# EAGLE design untitled (EAGLE 4.16)
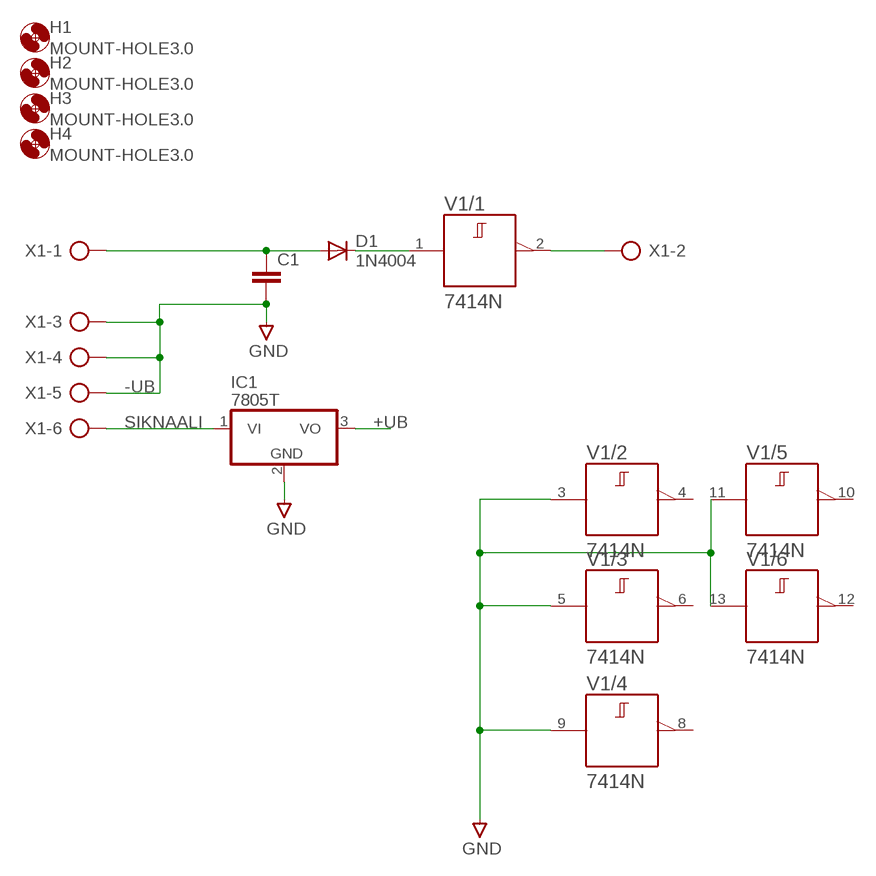
[diagram p0: schematic, sheet 1]

## Parts
C1  C-EU050-035X075  [C050-035X075]
D1  1N4004  [DO41-10]
H1  MOUNT-HOLE3.0  [3,0]
H2  MOUNT-HOLE3.0  [3,0]
H3  MOUNT-HOLE3.0  [3,0]
H4  MOUNT-HOLE3.0  [3,0]
IC1  7805T  [TO220H]
V1  7414N  [DIL14]
X1  AK300/6  [AK300/6]

## Nets
+UB: IC1.3(VO)
-UB: C1.2 IC1.2(GND) V1.3(/2:A) V1.5(/3:A) V1.9(/4:A) V1.11(/5:A) V1.13(/6:A) X1.3 X1.4 X1.5 ; supply symbol labelled GND
N$1: C1.1 D1.A X1.1
N$2: D1.C V1.1(/1:A)
N$3: V1.2(/1:Y) X1.2
SIKNAALI: IC1.1(VI) X1.6
Unconnected: V1.4(/2:Y) V1.6(/3:Y) V1.8(/4:Y) V1.10(/5:Y) V1.12(/6:Y)

## Power pins joined to a net without a drawn wire
+UB: V1.14(/+UB:+UB)
-UB: V1.7(/-UB:-UB)

## Library data of the parts
C1 = rcl:C-EU: CAPACITOR, European symbol
D1 = diode:1N4004: DIODE general purpose rectifier, 1 A
H1-H4 = holes:MOUNT-HOLE: MOUNTING HOLE with drill center marker
IC1 = linear2:78*: Positive VOLTAGE REGULATOR
V1 = 74ttl-din:74*14: Hex schmitt trigger INVERTER
X1 = con-ptr500:AK300/6: CONNECTOR

## Board
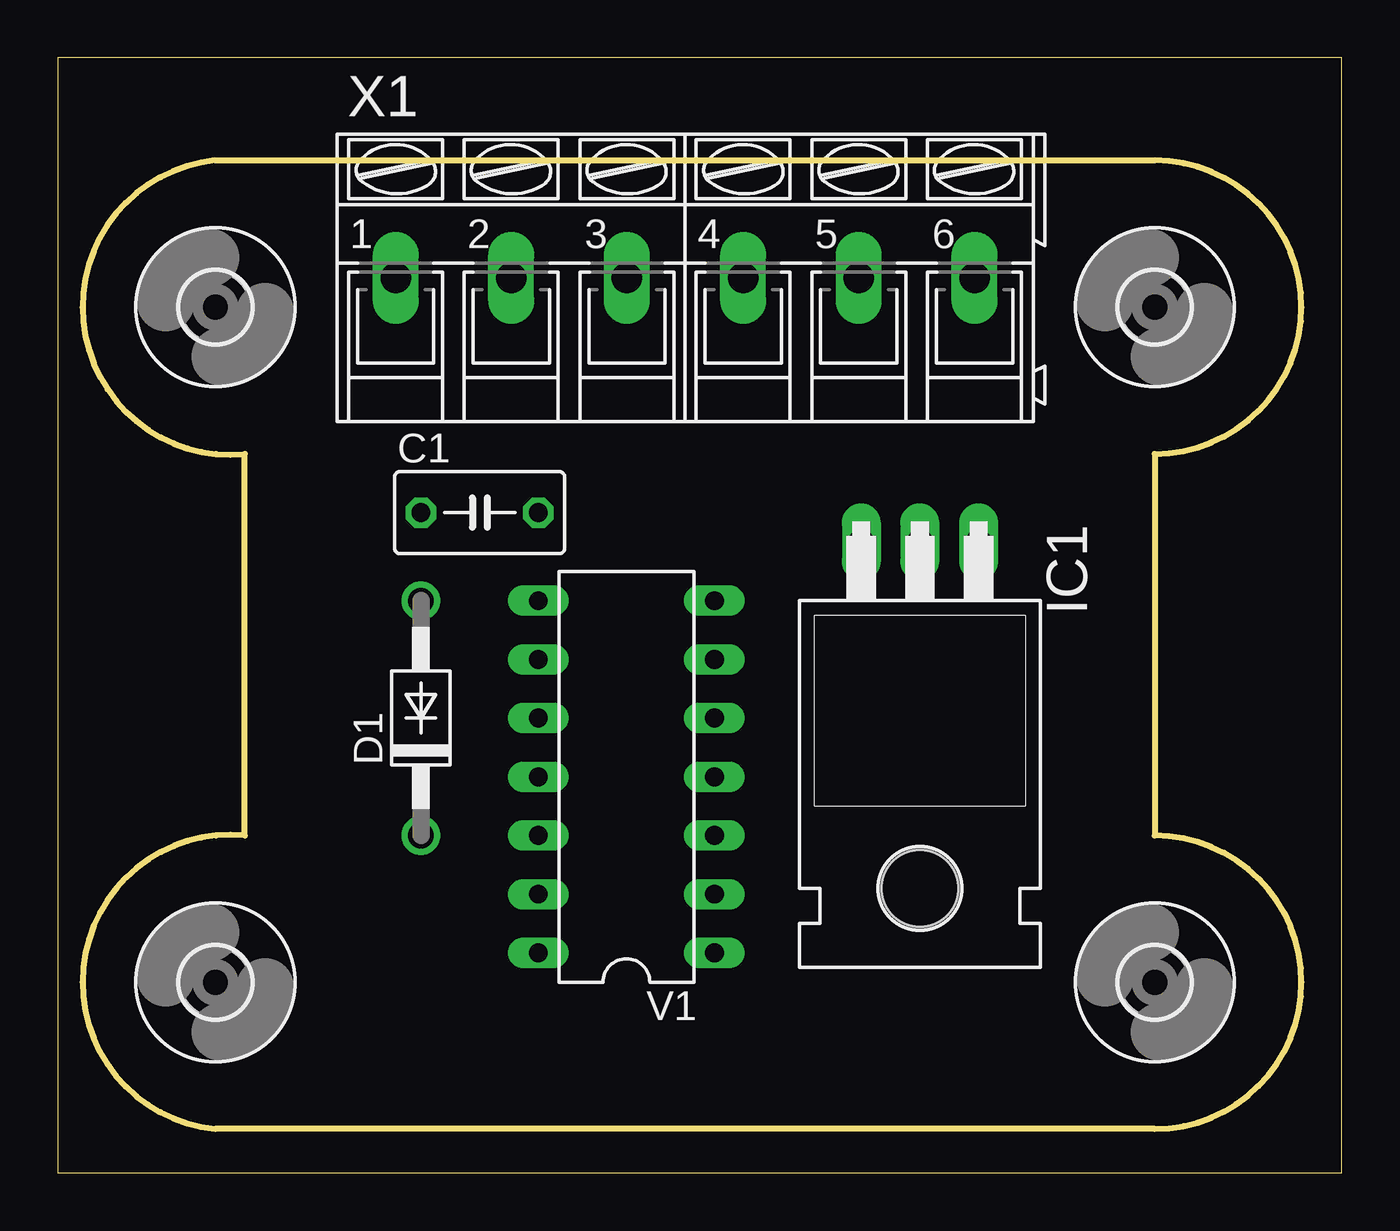
[diagram p1: board, top side]
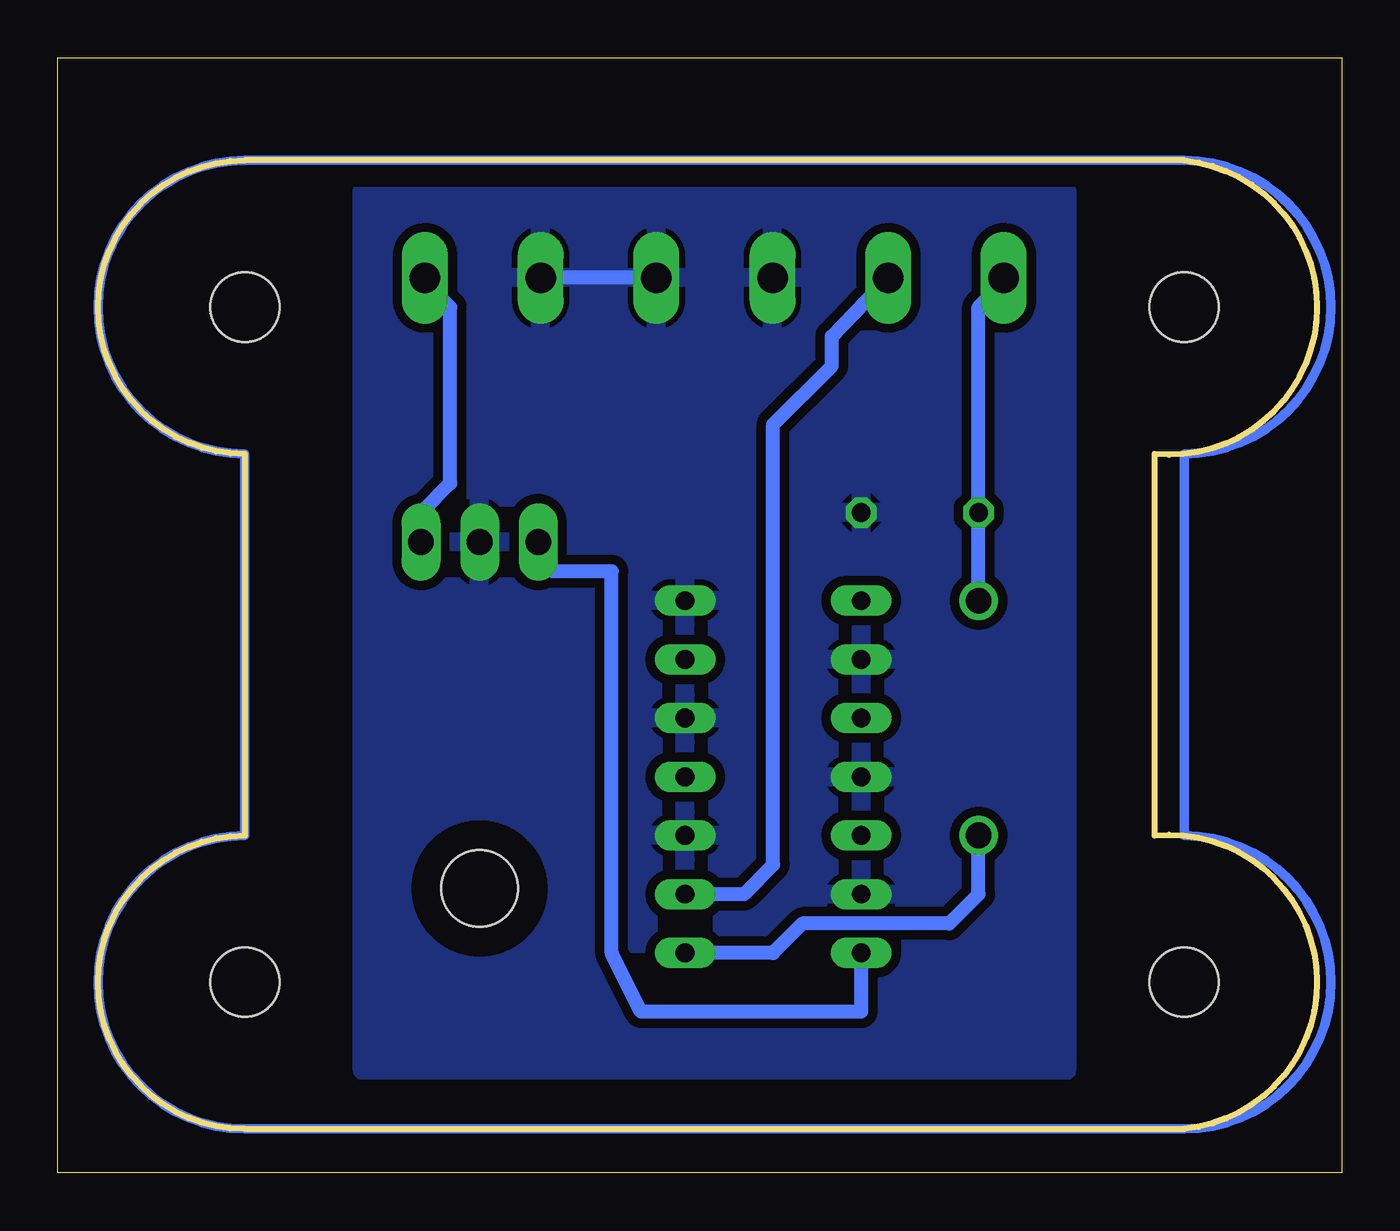
[diagram p2: board, bottom side, seen from below]

Size 55.55 x 48.25 mm. Coordinates in mm from the lower left corner, seen from the top.
Outline: 0,0 55.55,0 55.55,48.25 0,48.25 0,0
Outline: 6.82,43.81 arc180 8.09,31.11 8.09,14.6 arc180 6.82,1.9 47.46,1.9 arc180 47.46,14.6 47.46,31.11 arc180 47.46,43.81 6.82,43.81
Copper layers (1*16): Top 0.035mm / dielectric 1.5mm / Bottom 0.035mm
Design rules "default": minimum track width 10mil, minimum drill 24mil, track to track 8mil, track to pad 8mil, pad to pad 8mil, via to via 8mil, smd to smd 8mil, copper to edge 40mil, drill to drill 8mil, minimum pad ring 10mil, minimum via ring 10mil, stop-mask expansion 4mil, vias tented up to drill 0mil, thermal gap 10mil

### Footprints (pad centres in the part's own frame; a part is rotated, then mirrored left to right if it is on the bottom)
C050-035X075 = drill 0.813 octagon: 1 -2.54,0; 2 2.54,0
DO41-10 = drill 1.118 round: A 5.08,0; C -5.08,0
3,0 = hole 3: 0,0
TO220H = drill 1.118 long: 1 -2.54,-10.16; 2 0,-10.16; 3 2.54,-10.16 | hole 3.302: 0,4.826
DIL14 = drill 0.813 long: 1 -7.62,-3.81; 2 -5.08,-3.81; 3 -2.54,-3.81; 4 0,-3.81; 5 2.54,-3.81; 6 5.08,-3.81; 7 7.62,-3.81; 8 7.62,3.81; 9 5.08,3.81; 10 2.54,3.81; 11 0,3.81; 12 -2.54,3.81; 13 -5.08,3.81; 14 -7.62,3.81
AK300/6 = drill 1.321 long: 1 -12.522,0; 2 -7.518,0; 3 -2.515,0; 4 2.515,0; 5 7.518,0; 6 12.522,0

### Placement (x,y rotation side)
C1  18.25,28.57 0 top
D1  15.71,19.68 90 top
H1  6.82,8.25 270 top
H2  6.82,37.46 270 top
H3  47.46,37.46 270 top
H4  47.46,8.25 270 top
IC1  37.3,17.14 180 top
V1  24.6,17.14 90 top
X1  27.14,38.73 0 top

### Tracks (layer width: path | path; a pad name or v marks a point on that pad's centre or on a via)
+UB
  Bottom 0.61: V1.14 20.79,6.98 30.31,6.98 31.58,9.52 31.58,26.03 34.12,26.03 IC1.3
-UB
  Bottom 0.61: 34.76,38.73 X1.5 X1.4
  pour Bottom (isolate 0.406): 42.38,42.54 11.9,42.54 11.9,4.44 42.38,4.44
N$1
  Bottom 0.61: D1.A C1.1 15.71,37.46 14.44,38.73 X1.1
N$2
  Bottom 0.61: V1.1 24.6,9.52 23.33,10.79 16.98,10.79 15.71,12.06 D1.C
N$3
  Bottom 0.61: V1.2 25.87,12.06 24.6,13.33 24.6,32.38 22.06,34.92 22.06,36.19 X1.2 19.52,38.73
N$4
  Bottom 0.406: 6.82,31.11 arc-180 6.82,43.81 47.46,43.81 arc-180 47.46,31.11 47.46,14.6 arc-180 47.46,1.9 6.82,1.9 arc-180 6.82,14.6 6.82,31.11
SIKNAALI
  Bottom 0.61: IC1.1 39.84,28.57 38.57,29.84 38.57,37.46 39.84,38.73 X1.6